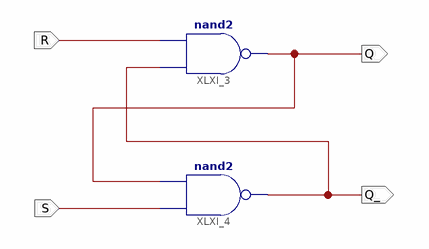
[diagram p0: schematic sheet 1]
// Xilinx ISE schematic SR_Latch_nand.sch (kintex7) as structural Verilog: 2 symbols, 4 ports
module SR_Latch_nand (
  input  R,
  input  S,
  output Q_,
  output Q
);

  nand XLXI_3 (Q, Q_, R);
  nand XLXI_4 (Q_, S, Q);
endmodule
